# Altium schematic sheet GPIO.SchDoc
size A4
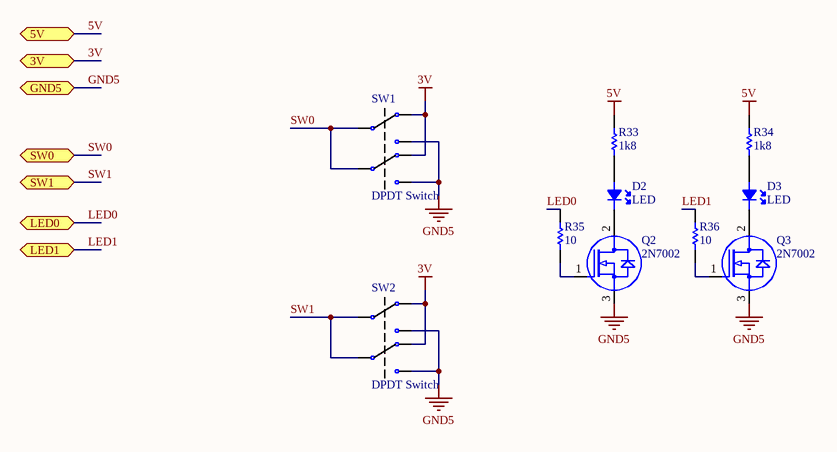
[diagram p0: GPIO.SchDoc]

## Parts
D2  LED  [0805LED]
D3  LED  [0805LED]
Q2  2N7002  [SOT23]
Q3  2N7002  [SOT23]
R33  1k8  [0805R]
R34  1k8  [0805R]
R35  10  [0805R]
R36  10  [0805R]
SW1  DPDT Switch  [DPDT]
SW2  DPDT Switch  [DPDT]

## Ports
3V, 5V, GND5, LED0, LED1, SW0, SW1

## Nets
3V: SW1.1 SW1.4 SW2.1 SW2.4 ; port 3V
5V: R33.2 R34.2 ; port 5V
GND5: Q2.3(SOURCE) Q3.3(SOURCE) SW1.3 SW1.6 SW2.3 SW2.6 ; port GND5
LED0: R35.2 ; port LED0
LED1: R36.2 ; port LED1
SW0: SW1.2 SW1.5 ; port SW0
SW1: SW2.2 SW2.5 ; port SW1
NetD2_1: D2.1(A) R33.1
NetD2_2: D2.2(K) Q2.2(DRAIN)
NetD3_1: D3.1(A) R34.1
NetD3_2: D3.2(K) Q3.2(DRAIN)
NetQ2_1: Q2.1(GATE) R35.1
NetQ3_1: Q3.1(GATE) R36.1

## Library data of the parts
D2 D3 = LED: COLOR: BLUE
R33-R36 = RESISTOR
  R33 R34: Value: 1k8
  R35 R36: Value: 10
SW1 SW2 = DPDT_Switch: FARNELL: 2320019
Q2 Q3 = 2N7002: FARNELL: 2306371